# EAGLE design Steeringwheel wired remote V2 (EAGLE 7.2.0)
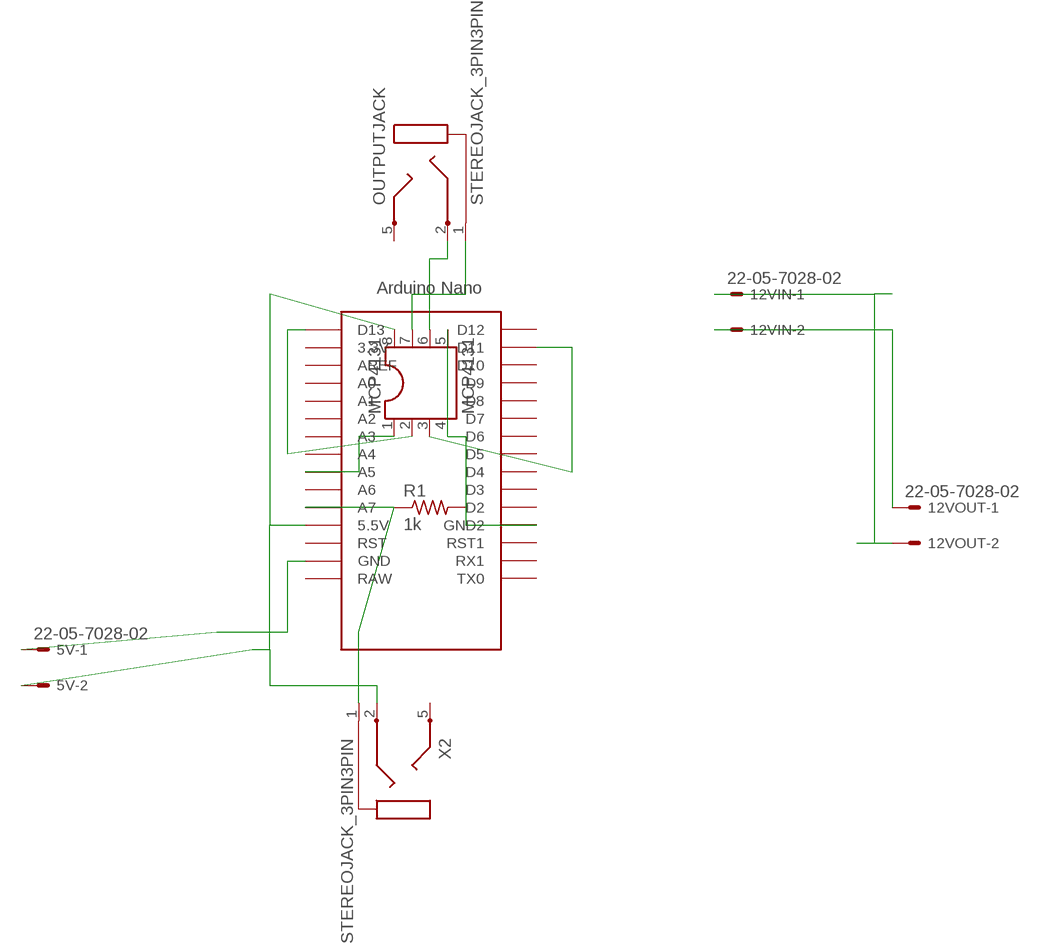
[diagram p0: schematic, sheet 1]

## Parts
5V  22-05-7028-02  [7395-02]
12VIN  22-05-7028-02  [7395-02]
12VOUT  22-05-7028-02  [7395-02]
IC1  MCP4131  DIL8  [DIL08]
OUTPUTJACK  STEREOJACK_3PIN3PIN  [STX3000]
R1  1k  R-US_0204/5  [0204/5]
U$2  NANO  [NANO_NOISPC]
X2  STEREOJACK_3PIN3PIN  [STX3000]

## Nets
GND: 5V.1 IC1.4(GND) IC1.5(P0A) R1.2 U$2.GND U$2.GND1(GND2)
N$1: IC1.3(SDI) U$2.D11
N$2: IC1.2(SCK) U$2.D13
N$4: R1.1 U$2.A7 X2.1
N$5: IC1.6(P0W) OUTPUTJACK.2
N$6: 5V.2 IC1.8(VCC) U$2.5V(5.5V) X2.2
N$8: 12VIN.1 12VOUT.2
N$9: 12VIN.2 12VOUT.1
N$10: IC1.1(!CS) U$2.A5
N$12: IC1.7(P0B) OUTPUTJACK.1
Unconnected: OUTPUTJACK.5 U$2.3.3V U$2.A0 U$2.A1 U$2.A2 U$2.A3 U$2.A4 U$2.A6 U$2.AREF U$2.D2 U$2.D3 U$2.D4 U$2.D5 U$2.D6 U$2.D7 U$2.D8 U$2.D9 U$2.D10 U$2.D12 U$2.RAW U$2.RST U$2.RST1 U$2.RX1 U$2.TX0 X2.5

## Library data of the parts
5V 12VIN 12VOUT = con-molex:22-?-02: CONNECTOR wire to board 2.54 mm (.1 inch) pitch header; OC_FARNELL: 9731601; OC_NEWARK: unknown
IC1 = Own:DIL8: Dual In Line / Socket
OUTPUTJACK X2 = my_lib:STEREOJACK_3PIN: MIC/HEADPHONE JACK Stereo jack with two switches. Kycon STX3100, CUI SJ1-3555NG and/or 4UCon 05544
R1 = adafruit:R-US_: RESISTOR, American symbol
U$2 = my_lib:NANO: Arduino Nano

## Board
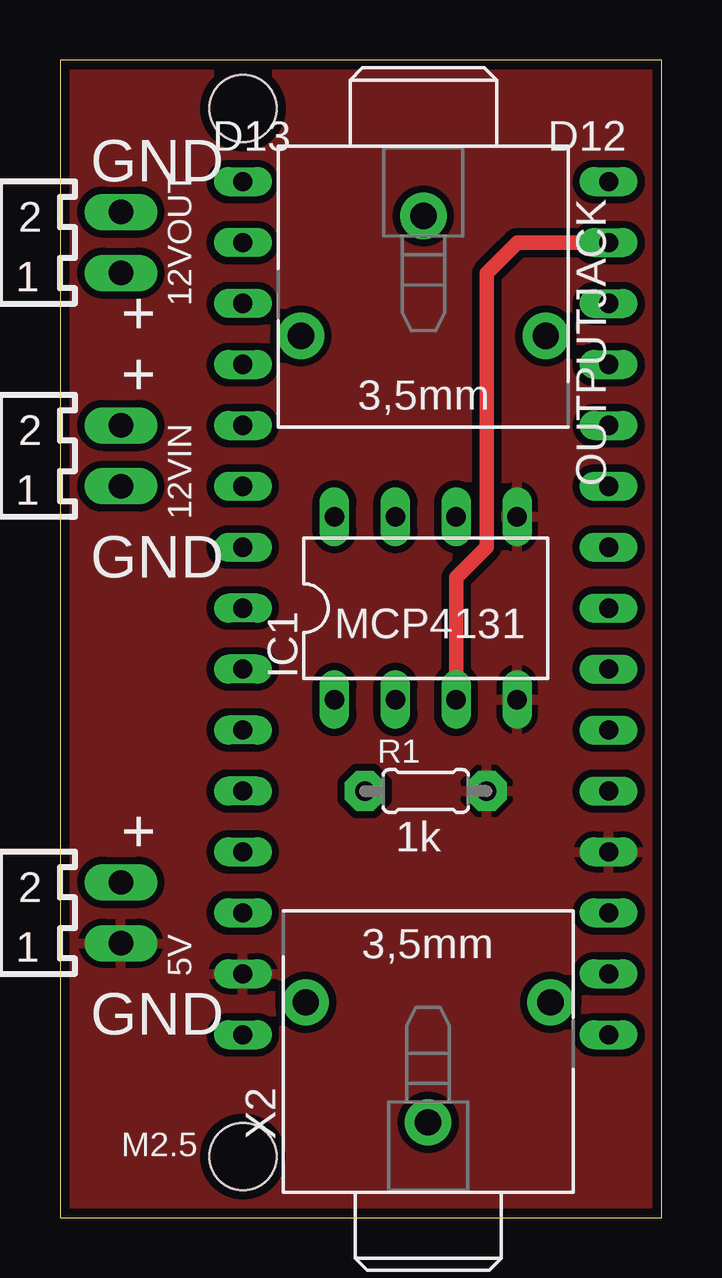
[diagram p1: board, top side]
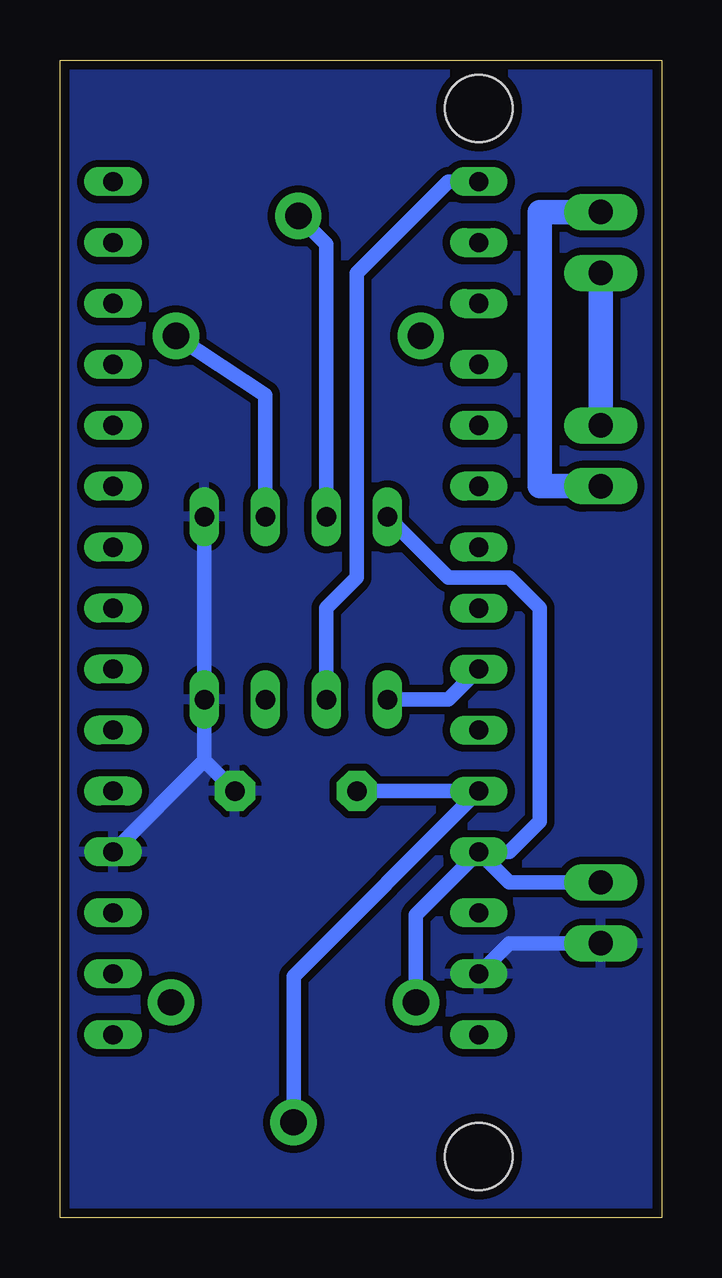
[diagram p2: board, bottom side, seen from below]

Size 25.07 x 48.25 mm. Coordinates in mm from the lower left corner, seen from the top.
Outline: 0,0 25.07,0 25.07,48.25 0,48.25 0,0
Copper layers (1*16): Top 0.0356mm / dielectric 1.5011mm / Bottom 0.0356mm
Design rules "oshpark-2layer": minimum track width 6mil, minimum drill 13mil, track to track 6mil, track to pad 6mil, pad to pad 6mil, via to via 6mil, smd to smd 6mil, copper to edge 15mil, drill to drill 6mil, minimum pad ring 7mil, minimum via ring 7mil, stop-mask expansion 2.5mil, vias tented up to drill 0mil, thermal gap 10mil
Holes 2.8 mm at 7.62,46.23 7.62,2.54

### Footprints (pad centres in the part's own frame; a part is rotated, then mirrored left to right if it is on the bottom)
7395-02 = drill 1.016 long: 1 1.27,0; 2 -1.27,0
DIL08 = drill 0.813 long: 1 -3.81,-3.81; 2 -1.27,-3.81; 3 1.27,-3.81; 4 3.81,-3.81; 5 3.81,3.81; 6 1.27,3.81; 7 -1.27,3.81; 8 -3.81,3.81
STX3000 = drill 1.1 pad 1.93: 1 0.16,-0.1; 2 5.16,5; 5 5.16,-5.2
0204/5 = drill 0.813 pad 1.676 octagon: 1 -2.54,0; 2 2.54,0
NANO_NOISPC = drill 0.8 long: 3.3V -10.16,24.13; 5V -10.16,-1.27; A0 -10.16,19.05; A1 -10.16,16.51; A2 -10.16,13.97; A3 -10.16,11.43; A4 -10.16,8.89; A5 -10.16,6.35; A6 -10.16,3.81; A7 -10.16,1.27; AREF -10.16,21.59; D2 5.08,1.27; D3 5.08,3.81; D4 5.08,6.35; D5 5.08,8.89; D6 5.08,11.43; D7 5.08,13.97; D8 5.08,16.51; D9 5.08,19.05; D10 5.08,21.59; D11 5.08,24.13; D12 5.08,26.67; D13 -10.16,26.67; GND -10.16,-6.35; GND1 5.08,-1.27; RAW -10.16,-8.89; RST -10.16,-3.81; RST1 5.08,-3.81; RX1 5.08,-6.35; TX0 5.08,-8.89

### Placement (x,y rotation side)
5V  2.54,12.7 270 top
12VIN  2.54,31.75 270 top
12VOUT  2.54,40.64 270 top
IC1  15.24,25.4 0 top
OUTPUTJACK  15.24,41.91 270 top
R1  15.24,17.78 0 top
U$2  17.78,16.51 0 top
X2  15.24,3.81 90 top

### Tracks (layer width: path | path; a pad name or v marks a point on that pad's centre or on a via)
GND
  Bottom 0.61: 19.05,19.05 IC1.4 IC1.5 | 19.05,19.05 U$2.GND1 | R1.2 19.05,19.05 | 5V.1 6.35,11.43 U$2.GND
  pour Bottom (isolate 0.305): 0,0 25.4,0 25.4,48.26 0,48.26
  pour Top (isolate 0.305): 0,0 25.4,0 25.4,48.26 0,48.26
N$1
  Top 0.61: IC1.3 16.51,26.67 17.78,27.94 17.78,39.37 19.05,40.64 U$2.D11
N$2
  Bottom 0.61: IC1.2 13.97,25.4 12.7,26.67 12.7,39.37 8.89,43.18 U$2.D13
N$4
  Bottom 0.61: R1.1 U$2.A7 15.34,10.06 X2.1
N$5
  Bottom 0.61: IC1.6 16.51,34.29 OUTPUTJACK.2
N$6
  Bottom 0.61: U$2.5V 6.35,15.24 5.08,16.51 5.08,25.4 6.35,26.67 8.89,26.67 IC1.8 | X2.2 10.24,12.62 U$2.5V | 5V.2 6.35,13.97 U$2.5V
N$8
  Bottom 1.016: 12VOUT.2 5.08,41.91 5.08,30.48 12VIN.1
N$9
  Bottom 1.016: 12VOUT.1 12VIN.2
N$10
  Bottom 0.61: IC1.1 8.89,21.59 U$2.A5
N$12
  Bottom 0.61: IC1.7 13.97,40.58 OUTPUTJACK.1

### Text on the board
tNames: D13 | D12 | GND | 1k | + | + | GND | MCP4131 | + | 1k | GND | M2.5